# EasyEDA schematic SCH_WiFiBTBitbanging_2025-02-11.json
TITLE: NRF24 Repeater; REV: 1.0; Date: 2025-02-11; Sheet: 1/1; Drawn By: ansonlai019; Company: Anson
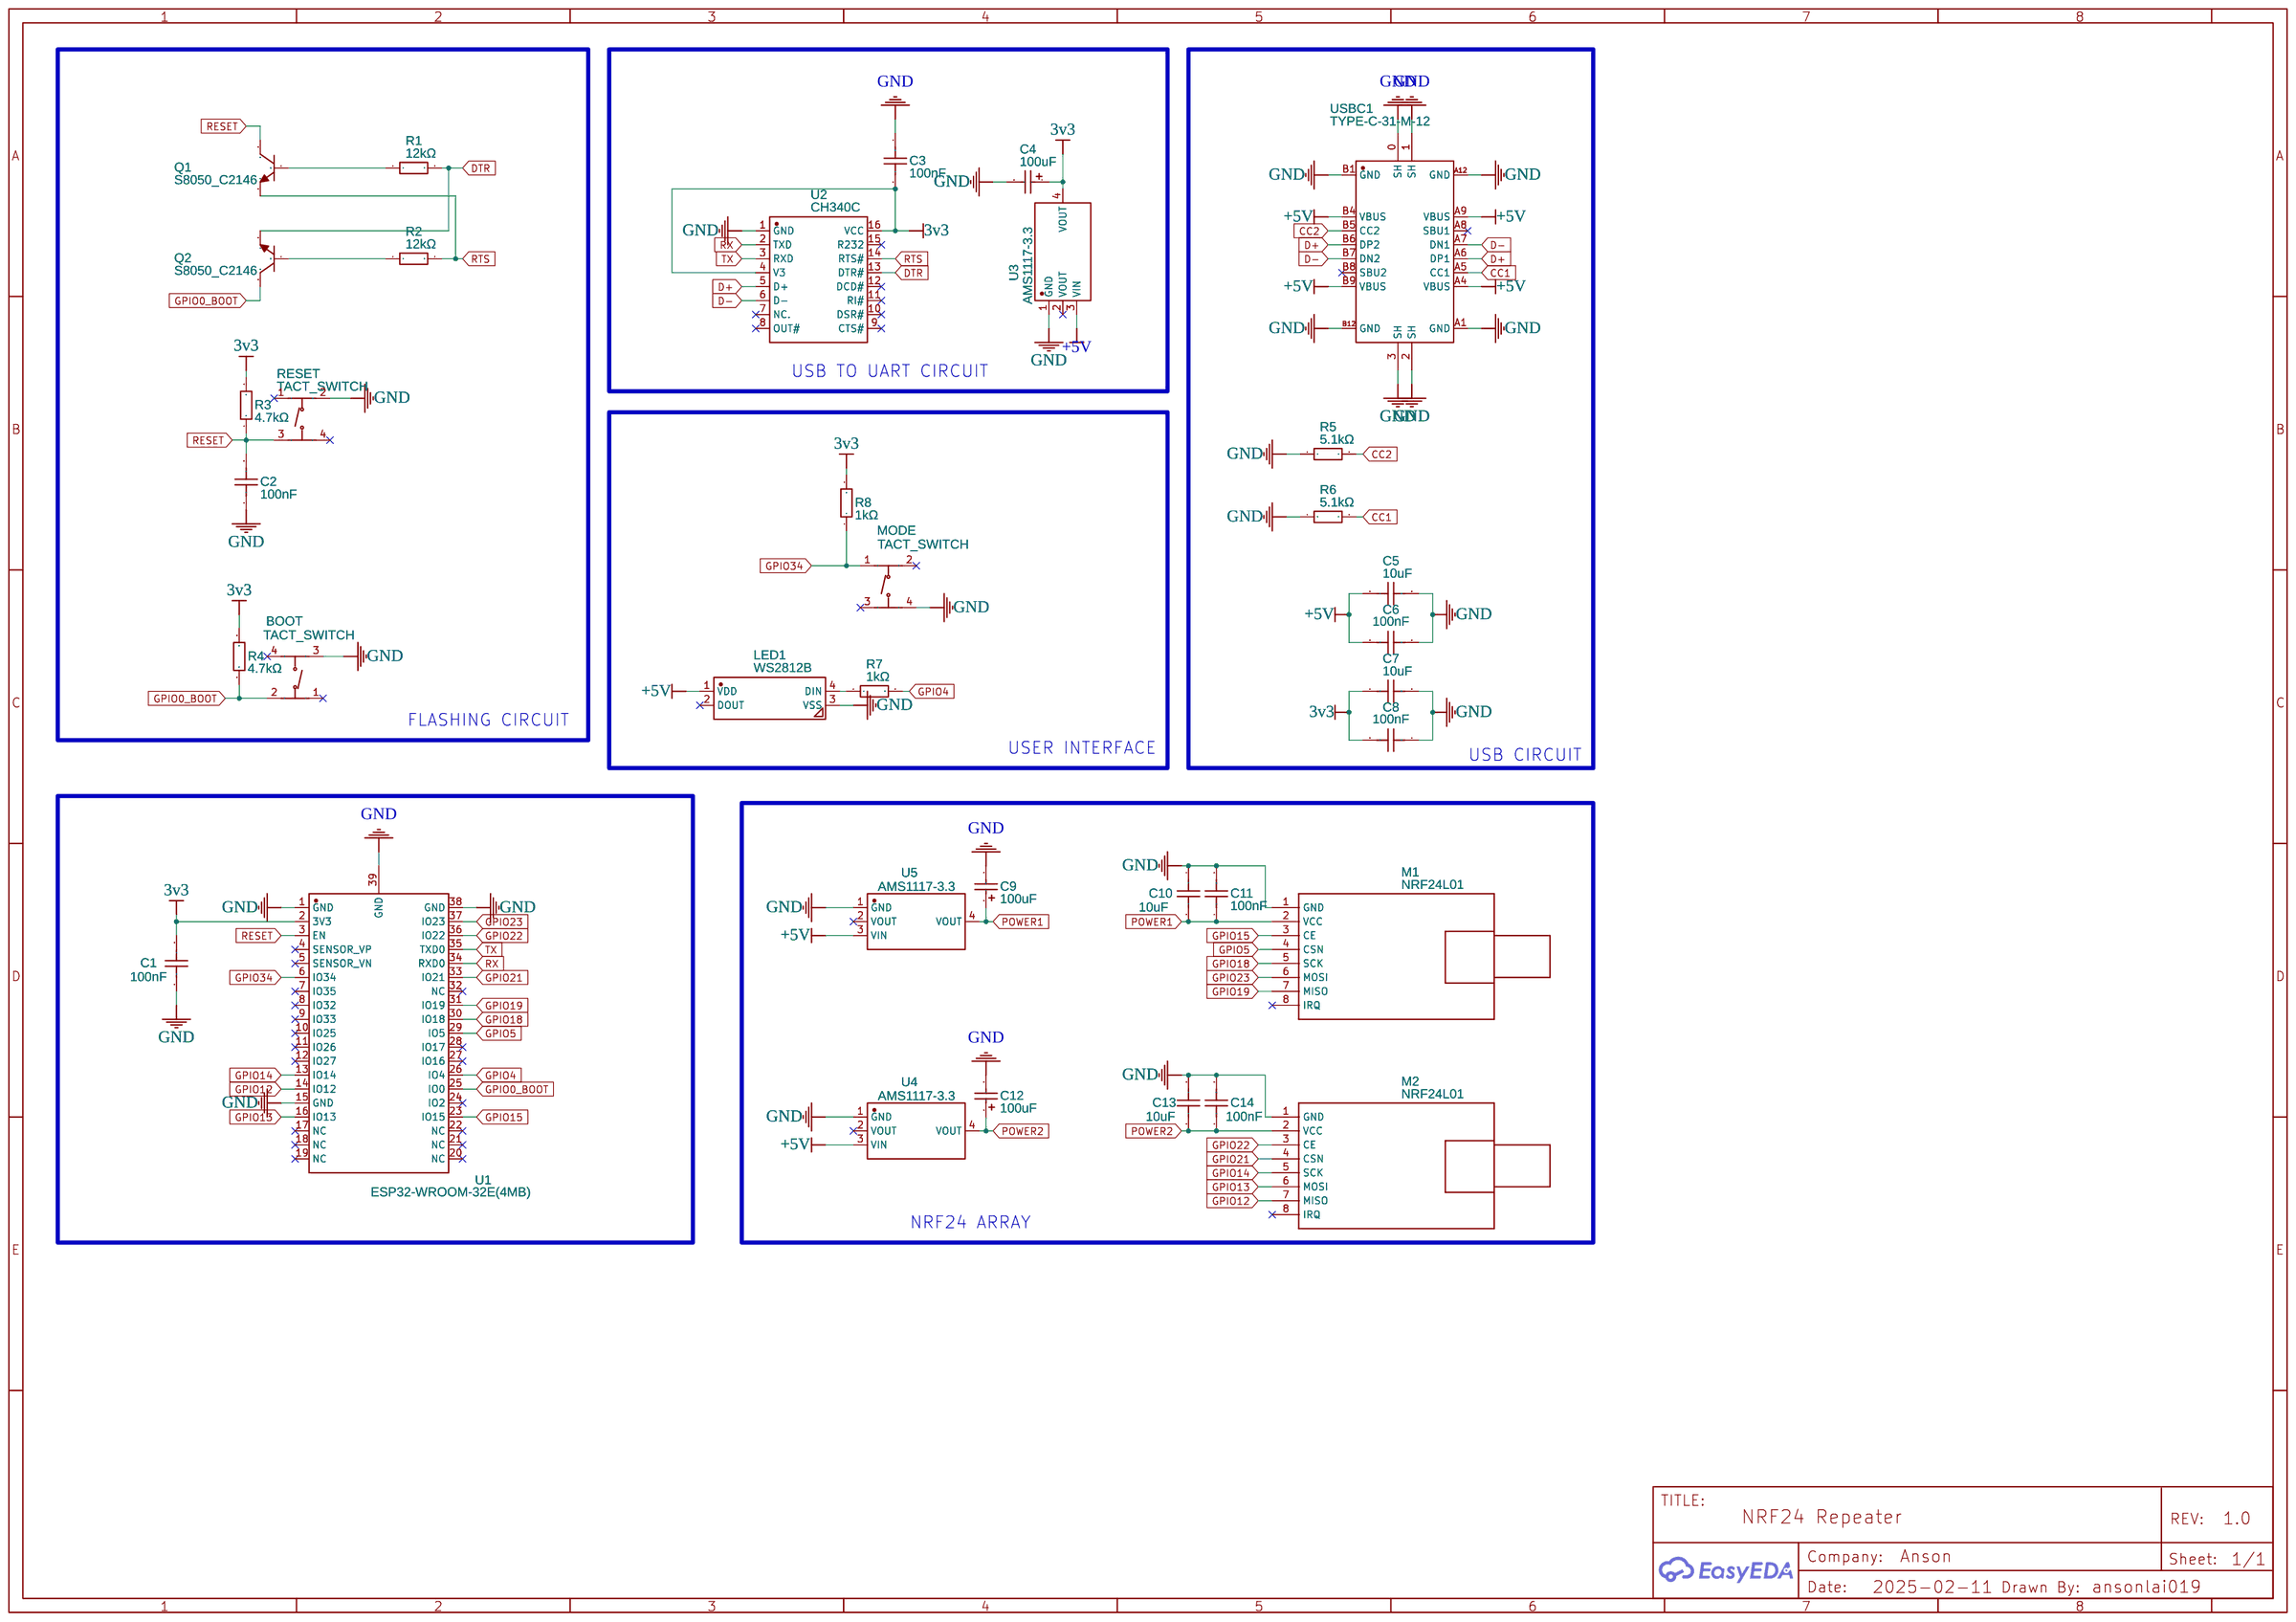
[diagram p0: schematic sheet]

## Parts
BOOT  TACT_SWITCH  [SW-SMD_4P-L5.1-W5.1-P3.70-LS6.5-TL_H1.5]
C1  100nF  [C0805]
C2  100nF  [C0805]
C3  100nF  [C0805]
C4  100uF  [CASE-B_3528]
C5  10uF  [C0805]
C6  100nF  [C0805]
C7  10uF  [C0805]
C8  100nF  [C0805]
C9  100uF  [CASE-B_3528]
C10  10uF  [C0805]
C11  100nF  [C0805]
C12  100uF  [CASE-B_3528]
C13  10uF  [C0805]
C14  100nF  [C0805]
LED1  WS2812B  [LED-SMD_4P-L5.0-W5.0-TL_WS2812B-B]
M1  NRF24L01  [WIRELESS-NRF24L01-PA-EXT]
M2  NRF24L01  [WIRELESS-NRF24L01-PA-EXT]
MODE  TACT_SWITCH  [SW-SMD_4P-L5.1-W5.1-P3.70-LS6.5-TL_H1.5]
Q1  S8050_C2146  [SOT-23-3_L3.0-W1.7-P0.95-LS2.9-BR]
Q2  S8050_C2146  [SOT-23-3_L3.0-W1.7-P0.95-LS2.9-BR]
R1  12kΩ  [R0805]
R2  12kΩ  [R0805]
R3  4.7kΩ  [R0805]
R4  4.7kΩ  [R0805]
R5  5.1kΩ  [R0805]
R6  5.1kΩ  [R0805]
R7  1kΩ  [R0805]
R8  1kΩ  [R0805]
RESET  TACT_SWITCH  [SW-SMD_4P-L5.1-W5.1-P3.70-LS6.5-TL_H1.5]
U1  ESP32-WROOM-32E(4MB)  [WIFI-SMD_ESP32-WROOM-32E]
U2  CH340C  [SOP-16_L10.0-W3.9-P1.27-LS6.0-BL]
U3  AMS1117-3.3  [SOT-223-3_L6.5-W3.4-P2.30-LS7.0-BR]
U4  AMS1117-3.3  [SOT-223-3_L6.5-W3.4-P2.30-LS7.0-BR]
U5  AMS1117-3.3  [SOT-223-3_L6.5-W3.4-P2.30-LS7.0-BR]
USBC1  TYPE-C-31-M-12  [USB-C_SMD-TYPE-C-31-M-12]

## Library data of the parts
BOOT MODE RESET = TS-1187A-B-A-B: Contributor: LCSC; Supplier: LCSC; Supplier Part: C318884; Manufacturer: XKB Connectivity(中国星坤); JLCPCB Part Class: Basic Part
C1-C3 C6 C8 C11 C14 = CC0805KRX7R9BB104: Supplier: LCSC; Manufacturer: YAGEO(国巨); Supplier Part: C49678; JLCPCB Part Class: Basic Part
C4 C9 C12 = TAJB107K006RNJ: Supplier: LCSC; Manufacturer: Kyocera AVX; Supplier Part: C16133; JLCPCB Part Class: Basic Part
C5 C7 C10 C13 = CL21A106KAYNNNE: Supplier: LCSC; Manufacturer: SAMSUNG(三星); Supplier Part: C15850; JLCPCB Part Class: Basic Part
LED1 = WS2812B-B/W: Contributor: LCSC; Supplier: LCSC; Supplier Part: C2761795; Manufacturer: worldsemi; Manufacturer Part: WS2812B-B/T; JLCPCB Part Class: Extended Part
M1 M2 = WIRELESS-NRF24L01-PA-EXT: Contributor: Daniel s
Q1 Q2 = S8050_C2146: Supplier: LCSC; Manufacturer: CJ(江苏长电/长晶); Manufacturer Part: S8050 J3Y(RANGE:200-350); Supplier Part: C2146; JLCPCB Part Class: Basic Part
R1 R2 = 0805W8F1202T5E: Supplier: LCSC; Manufacturer: UNI-ROYAL(厚声); Supplier Part: C17444; JLCPCB Part Class: Basic Part
R3 R4 = 0805W8F4701T5E: Supplier: LCSC; Manufacturer: UNI-ROYAL(厚声); Supplier Part: C17673; JLCPCB Part Class: Basic Part
R5 R6 = 0805W8F5101T5E: Supplier: LCSC; Manufacturer: UNI-ROYAL(厚声); Supplier Part: C27834; JLCPCB Part Class: Basic Part
R7 R8 = 0805W8F1001T5E: Supplier: LCSC; Manufacturer: UNI-ROYAL(厚声); Supplier Part: C17513; JLCPCB Part Class: Basic Part
U1 = ESP32-WROOM-32E(4MB): Contributor: LCSC; Supplier: LCSC; Supplier Part: C701341; Manufacturer: ESPRESSIF(乐鑫); Manufacturer Part: ESP32-WROOM-32E-N4; JLCPCB Part Class: Extended Part
U2 = CH340C: Supplier: LCSC; Manufacturer: WCH(南京沁恒); Supplier Part: C84681; JLCPCB Part Class: Extended Part
U3-U5 = AMS1117-3.3: sourceId: dwIGgezVh; Supplier: LCSC; Manufacturer: AMS; Supplier Part: C6186; JLCPCB Part Class: Basic Part
USBC1 = TYPE-C-31-M-12: Contributor: LCSC; Supplier: LCSC; Supplier Part: C165948; Manufacturer: 韩国韩荣; JLCPCB Part Class: Extended Part

## Nets
3v3: C1.2 C3.2 C4.1 C7.1 C8.2 R3.2 R4.2 R8.2 U1.2(3V3) U2.4(V3) U2.16(VCC) U3.4(VOUT)
+5V: C5.1 C6.2 LED1.1(VDD) U3.3(VIN) U4.3(VIN) U5.3(VIN) USBC1.A4(VBUS) USBC1.A9(VBUS) USBC1.B4(VBUS) USBC1.B9(VBUS)
GND: BOOT.3(C) C1.1 C2.1 C3.1 C4.2 C5.2 C6.1 C7.2 C8.1 C9.2 C10.1 C11.2 C12.2 C13.1 C14.2 LED1.3(VSS) M1.1(GND) M2.1(GND) MODE.4(D) R5.1 R6.1 RESET.2(B) U1.1(GND) U1.15(GND) U1.38(GND) U1.39(GND) U2.1(GND) U3.1(GND) U4.1(GND) U5.1(GND) USBC1.0(SH) USBC1.1(SH) USBC1.2(SH) USBC1.3(SH) USBC1.A1(GND) USBC1.A12(GND) USBC1.B1(GND) USBC1.B12(GND)
CC1: R6.2 USBC1.A5(CC1)
CC2: R5.2 USBC1.B5(CC2)
D+: U2.5(D+) USBC1.A6(DP1) USBC1.B6(DP2)
D-: U2.6(D-) USBC1.A7(DN1) USBC1.B7(DN2)
DTR: Q2.2(E) R1.2 U2.13(DTR#)
GPIO0_BOOT: BOOT.2(B) Q2.3(C) R4.1 U1.25(IO0)
GPIO4: R7.2 U1.26(IO4)
GPIO5: M1.4(CSN) U1.29(IO5)
GPIO12: M2.7(MISO) U1.14(IO12)
GPIO13: M2.6(MOSI) U1.16(IO13)
GPIO14: M2.5(SCK) U1.13(IO14)
GPIO15: M1.3(CE) U1.23(IO15)
GPIO18: M1.5(SCK) U1.30(IO18)
GPIO19: M1.7(MISO) U1.31(IO19)
GPIO21: M2.4(CSN) U1.33(IO21)
GPIO22: M2.3(CE) U1.36(IO22)
GPIO23: M1.6(MOSI) U1.37(IO23)
GPIO34: MODE.1(A) R8.1 U1.6(IO34)
POWER1: C9.1 C10.2 C11.1 M1.2(VCC) U5.4(VOUT)
POWER2: C12.1 C13.2 C14.1 M2.2(VCC) U4.4(VOUT)
RESET: C2.2 Q1.3(C) R3.1 RESET.3(C) U1.3(EN)
RTS: Q1.2(E) R2.2 U2.14(RTS#)
RX: U1.34(RXD0) U2.2(TXD)
TX: U1.35(TXD0) U2.3(RXD)
Net-(LED1-4): LED1.4(DIN) R7.1
Net-(Q1-1): Q1.1(B) R1.1
Net-(Q2-1): Q2.1(B) R2.1

Not connected (* = marked no-connect by the designer): BOOT 1(A)* 4(D)*; LED1 2(DOUT)*; M1 8(IRQ)*; M2 8(IRQ)*; MODE 2(B)* 3(C)*; RESET 1(A)* 4(D)*; U1 4(SENSOR_VP)* 5(SENSOR_VN)* 7(IO35)* 8(IO32)* 9(IO33)* 10(IO25)* 11(IO26)* 12(IO27)* 17(NC)* 18(NC)* 19(NC)* 20(NC)* 21(NC)* 22(NC)* 24(IO2)* 27(IO16)* 28(IO17)* 32(NC)*; U2 7(NC.)* 8(OUT#)* 9(CTS#)* 10(DSR#)* 11(RI#)* 12(DCD#)* 15(R232)*; U3 2(VOUT)*; U4 2(VOUT)*; U5 2(VOUT)*; USBC1 A8(SBU1)* B8(SBU2)*

## Notes on the sheet
- USB TO UART CIRCUIT
- FLASHING CIRCUIT
- USER INTERFACE
- USB CIRCUIT
- NRF24 ARRAY
